# EAGLE design WixelTherm (EAGLE 6.4)
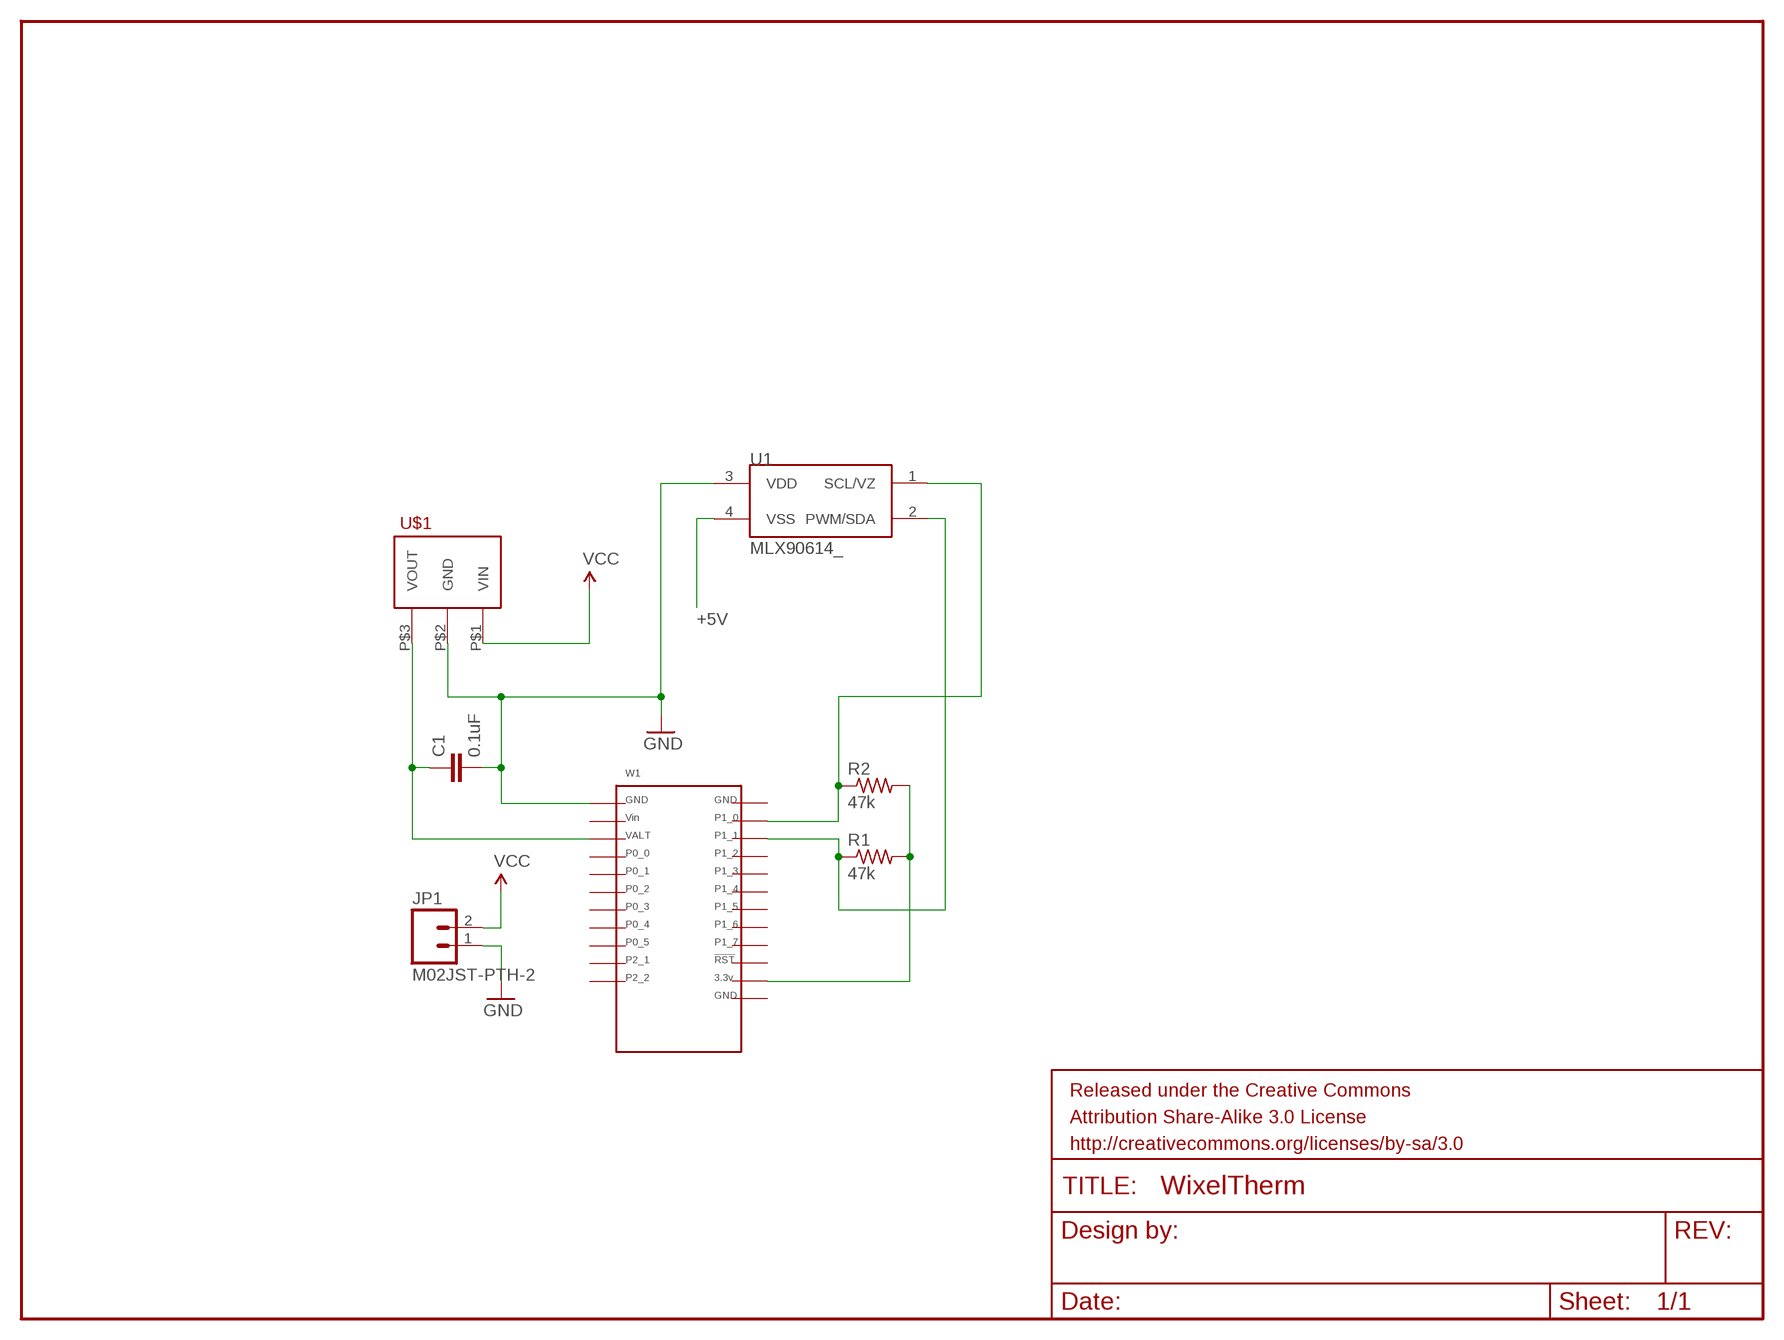
[diagram p0: schematic, sheet 1]

## Parts
C1  0.1uF  0.1UF-25V(+80/-20%)(0603)  [0603-CAP]
FRAME1  FRAME-LETTER  [CREATIVE_COMMONS]
JP1  M02JST-PTH-2  [JST-2-PTH]
R1  47k  R-US_0207/10  [0207/10]
R2  47k  R-US_0207/10  [0207/10]
U1  MLX90614_  [TO-39]
U$1  POLOLU_NCP1402  [POLOLU_BREAKOUT]
W1  WIXEL  [WIXEL]

## Nets
+5V: C1.1 U1.4(VSS) U$1.P$3(VOUT) W1.P$3
GND: C1.2 JP1.1 U1.3(VDD) U$1.P$2(GND) W1.P$1
N$2: R1.1 U1.2(PWM/SDA) W1.P$14
N$3: R1.2 R2.2 W1.P$22
N$4: R2.1 U1.1(SCL/VZ) W1.P$13
VCC: JP1.2 U$1.P$1(VIN)
Unconnected: W1.P$2 W1.P$4 W1.P$5 W1.P$6 W1.P$7 W1.P$8 W1.P$9 W1.P$10 W1.P$11 W1.P$12 W1.P$15 W1.P$16 W1.P$17 W1.P$18 W1.P$19 W1.P$20 W1.P$21 W1.P$23

## Library data of the parts
C1 = SparkFun-Capacitors:0.1UF-25V(+80/-20%)(0603): Ceramic Standard decoupling cap CAP-00810; PROD_ID: CAP-00810
FRAME1 = SparkFun-Aesthetics:FRAME-LETTER: Schematic Frame Standard 8.5x11 US Letter frame
JP1 = SparkFun-Connectors:M02: Standard 2-pin 0.1" header. Use with - straight break away headers ( PRT-00116) - right angle break away headers (PRT-00553) - swiss pins (PRT-00743) - machine pins (PRT-00117) - female headers (PRT-00115) Molex polarized connector foot print use with: PRT-08233 with associated crimp pins and housings. 2.54_SCREWTERM for use with PRT-10571. 3.5mm Screw Terminal footprints for PRT-08084 5mm Screw Terminal footprints for use with PRT-08433
R1 R2 = rcl:R-US_: RESISTOR, American symbol
U1 = SparkFun-Sensors:MLX90614: Non-contact PIR I2C interface temperature sensor
U$1 = PololuNCP1402:POLOLU_NCP1402
W1 = wixel:WIXEL

## Board
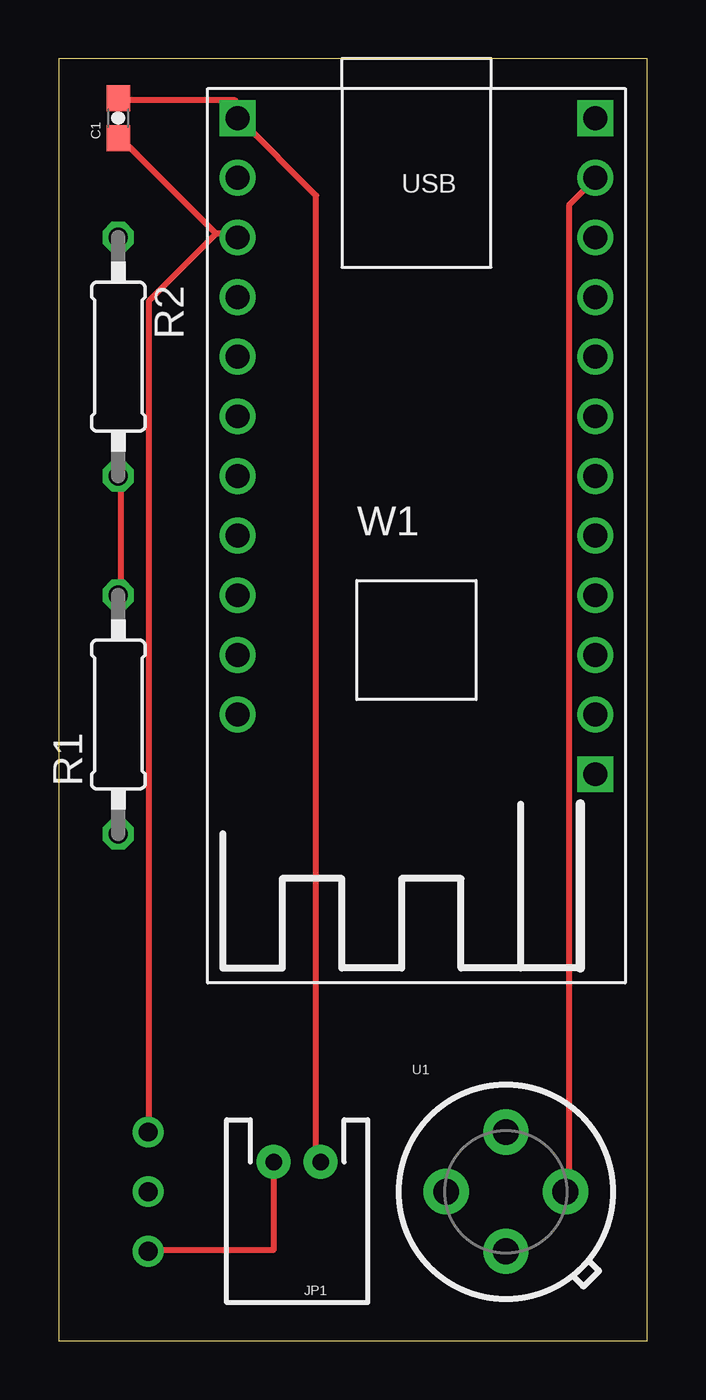
[diagram p1: board, top side]
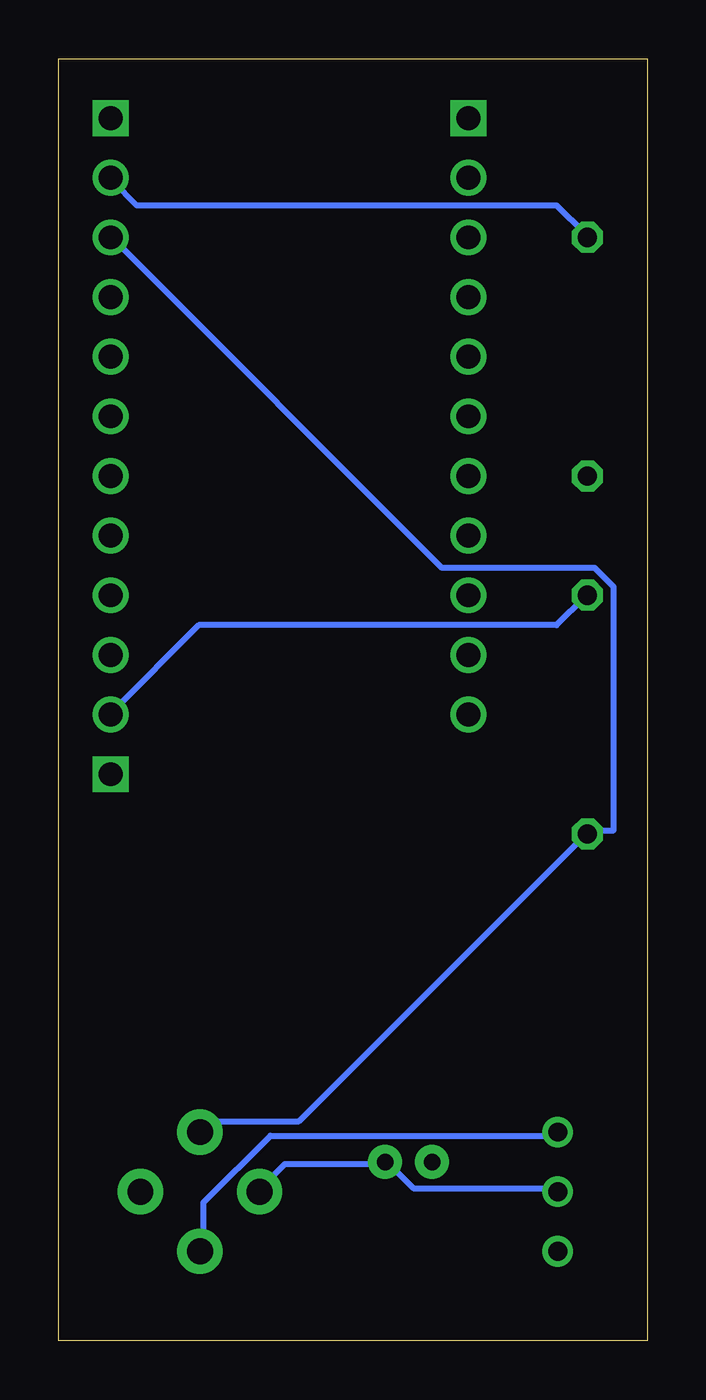
[diagram p2: board, bottom side, seen from below]

Size 25.07 x 54.6 mm. Coordinates in mm from the lower left corner, seen from the top.
Outline: 0,0 25.07,0 25.07,54.6 0,54.6 0,0
Copper layers (1*16): Top 0.035mm / dielectric 1.5mm / Bottom 0.035mm
Design rules "default": minimum track width 10mil, minimum drill 24mil, track to track 8mil, track to pad 8mil, pad to pad 8mil, via to via 8mil, smd to smd 8mil, copper to edge 40mil, drill to drill 8mil, minimum pad ring 10mil, minimum via ring 8mil, stop-mask expansion 4mil, vias tented up to drill 0mil, thermal gap 10mil

### Footprints (pad centres in the part's own frame; a part is rotated, then mirrored left to right if it is on the bottom)
0603-CAP = smd 1.1 x 1: 1 -0.85,0; 2 0.85,0
JST-2-PTH = drill 0.7 pad 1.448: 1 -1,0; 2 1,0
0207/10 = drill 0.813 octagon: 1 -5.08,0; 2 5.08,0
TO-39 = drill 1.1 pad 1.93: 1 2.54,0; 2 0,2.54; 3 -2.54,0; 4 0,-2.54
POLOLU_BREAKOUT = drill 0.8: P$1 -2.54,0; P$2 0,0; P$3 2.54,0
WIXEL = drill 1.016 square: P$1 -7.62,17.78; P$12 7.62,17.78; P$23 7.62,-10.16 | drill 1.016: P$2 -7.62,15.24; P$3 -7.62,12.7; P$4 -7.62,10.16; P$5 -7.62,7.62; P$6 -7.62,5.08; P$7 -7.62,2.54; P$8 -7.62,0; P$9 -7.62,-2.54; P$10 -7.62,-5.08; P$11 -7.62,-7.62; P$13 7.62,15.24; P$14 7.62,12.7; P$15 7.62,10.16; P$16 7.62,7.62; P$17 7.62,5.08; P$18 7.62,2.54; P$19 7.62,0; P$20 7.62,-2.54; P$21 7.62,-5.08; P$22 7.62,-7.62

### Placement (x,y rotation side)
C1  2.54,52.07 90 top
FRAME1  -77.47,41.91 0 top  (outside the outline)
JP1  10.16,7.62 180 top
R1  2.54,26.67 90 top
R2  2.54,41.91 270 top
U1  19.05,6.35 0 top
U$1  3.81,6.35 90 top
W1  15.24,34.29 0 top

### Tracks (layer width: path | path; a pad name or v marks a point on that pad's centre or on a via)
+5V
  Top 0.254: 6.71,47.14 2.64,51.21 C1.1 | 6.71,47.14 7.52,47.14 W1.P$3 | 6.71,47.14 3.86,44.3 3.86,8.94 U$1.P$3
  Bottom 0.254: U$1.P$3 3.86,8.74 16.05,8.74 18.9,5.89 18.9,3.86 U1.4
GND
  Top 0.254: C1.2 2.64,52.83 7.52,52.83 7.52,52.22 W1.P$1 7.72,52.02 10.97,48.77 10.97,7.72 JP1.1
  Bottom 0.254: U$1.P$2 3.86,6.5 9.96,6.5 10.97,7.52 JP1.1 11.18,7.52 15.44,7.52 16.46,6.5 U1.3
N$2
  Bottom 0.254: U1.2 18.9,8.94 18.49,9.35 14.83,9.35 2.64,21.54 R1.1 2.44,21.74 1.42,21.74 1.42,32.11 2.23,32.92 8.74,32.92 22.76,46.94 W1.P$14
N$3
  Top 0.254: R1.2 2.64,31.9 2.64,36.78 R2.2
  Bottom 0.254: W1.P$22 22.76,26.82 19.1,30.48 3.86,30.48 2.64,31.7 R1.2
N$4
  Top 0.254: U1.1 21.74,6.5 21.74,48.36 22.76,49.38 W1.P$13
  Bottom 0.254: R2.1 2.64,47.14 3.86,48.36 21.74,48.36 22.76,49.38 W1.P$13
VCC
  Top 0.254: U$1.P$1 3.86,3.86 9.14,3.86 9.14,7.52 JP1.2